# EAGLE design Alimentation (EAGLE 9.3.2)
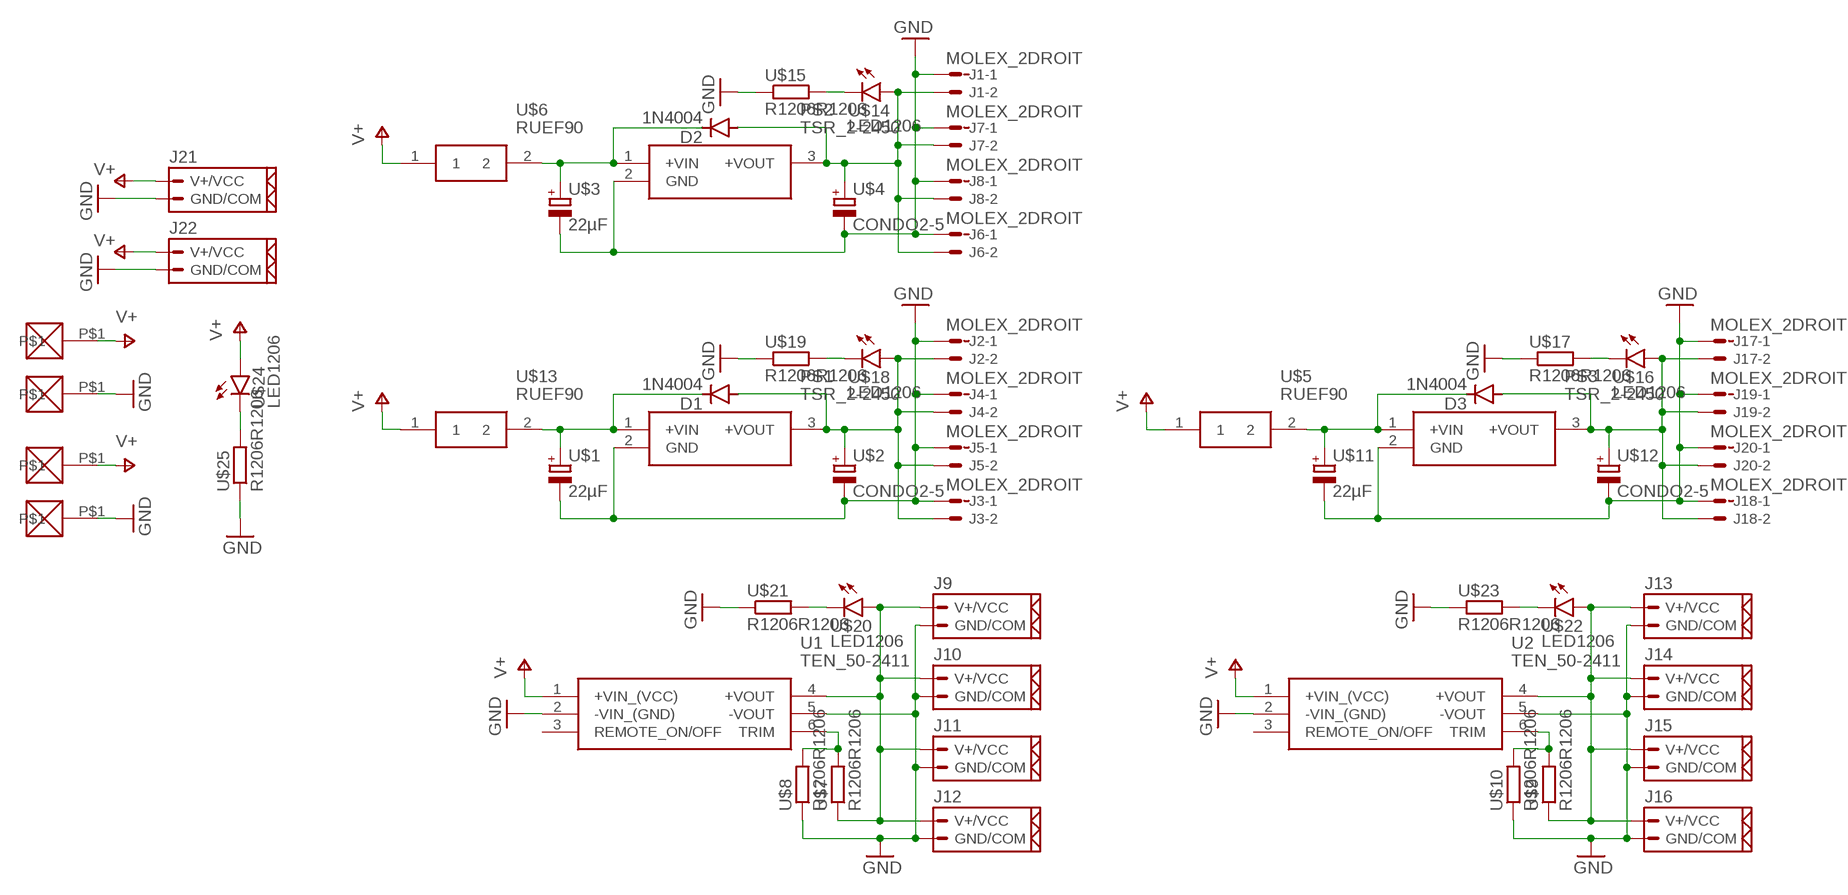
[diagram p0: schematic, sheet 1]

## Parts
D1  1N4004  [DO41-10]
D2  1N4004  [DO41-10]
D3  1N4004  [DO41-10]
J1  MOLEX_2DROIT  [CON_2_DROIT]
J2  MOLEX_2DROIT  [CON_2_DROIT]
J3  MOLEX_2DROIT  [CON_2_DROIT]
J4  MOLEX_2DROIT  [CON_2_DROIT]
J5  MOLEX_2DROIT  [CON_2_DROIT]
J6  MOLEX_2DROIT  [CON_2_DROIT]
J7  MOLEX_2DROIT  [CON_2_DROIT]
J8  MOLEX_2DROIT  [CON_2_DROIT]
J9  MOLEX_2_PUISSDROIT  [CON_2_PUISS_DROIT]
J10  MOLEX_2_PUISSDROIT  [CON_2_PUISS_DROIT]
J11  MOLEX_2_PUISS90°  [CON_2_PUISS_90°]
J12  MOLEX_2_PUISS90°  [CON_2_PUISS_90°]
J13  MOLEX_2_PUISSDROIT  [CON_2_PUISS_DROIT]
J14  MOLEX_2_PUISSDROIT  [CON_2_PUISS_DROIT]
J15  MOLEX_2_PUISS90°  [CON_2_PUISS_90°]
J16  MOLEX_2_PUISS90°  [CON_2_PUISS_90°]
J17  MOLEX_2DROIT  [CON_2_DROIT]
J18  MOLEX_2DROIT  [CON_2_DROIT]
J19  MOLEX_2DROIT  [CON_2_DROIT]
J20  MOLEX_2DROIT  [CON_2_DROIT]
J21  MOLEX_2_PUISS90°  [CON_2_PUISS_90°]
J22  MOLEX_2_PUISS90°  [CON_2_PUISS_90°]
PS1  TSR_2-2450  [TSR-2]
PS2  TSR_2-2450  [TSR-2]
PS3  TSR_2-2450  [TSR-2]
U1  TEN_50-2411  [TEN_50-2411]
U2  TEN_50-2411  [TEN_50-2411]
U$1  22µF  CONDO2-5  [E2-5]
U$2  CONDO2-5  [E2-5]
U$3  22µF  CONDO2-5  [E2-5]
U$4  CONDO2-5  [E2-5]
U$5  RUEF90  [RUEF090]
U$6  RUEF90  [RUEF090]
U$7  R1206R1206  [R1206]
U$8  R1206R1206  [R1206]
U$9  R1206R1206  [R1206]
U$10  R1206R1206  [R1206]
U$11  22µF  CONDO2-5  [E2-5]
U$12  CONDO2-5  [E2-5]
U$13  RUEF90  [RUEF090]
U$14  LED1206  [1206]
U$15  R1206R1206  [R1206]
U$16  LED1206  [1206]
U$17  R1206R1206  [R1206]
U$18  LED1206  [1206]
U$19  R1206R1206  [R1206]
U$20  LED1206  [1206]
U$21  R1206R1206  [R1206]
U$22  LED1206  [1206]
U$23  R1206R1206  [R1206]
U$24  LED1206  [1206]
U$25  R1206R1206  [R1206]
U$26  BAT_WIRE_SOLD  [LARGE_PAD_BATT]
U$27  BAT_WIRE_SOLD  [LARGE_PAD_BATT]
U$28  BAT_WIRE_SOLD  [LARGE_PAD_BATT]
U$29  BAT_WIRE_SOLD  [LARGE_PAD_BATT]

## Nets
GND: J1.1 J2.1 J3.1 J4.1 J5.1 J6.1 J7.1 J8.1 J9.1(GND/COM) J10.1(GND/COM) J11.P$1(GND/COM) J12.P$1(GND/COM) J13.1(GND/COM) J14.1(GND/COM) J15.P$1(GND/COM) J16.P$1(GND/COM) J17.1 J18.1 J19.1 J20.1 J21.P$1(GND/COM) J22.P$1(GND/COM) PS1.2(GND) PS2.2(GND) PS3.2(GND) U1.2(-VIN_(GND)) U1.5(-VOUT) U2.2(-VIN_(GND)) U2.5(-VOUT) U$1.- U$2.- U$3.- U$4.- U$8.1 U$10.1 U$11.- U$12.- U$15.1 U$17.1 U$19.1 U$21.1 U$23.1 U$25.1 U$26.P$1 U$28.P$1
N$1: D1.C PS1.1(+VIN) U$1.+ U$13.2
N$2: D2.C PS2.1(+VIN) U$3.+ U$6.2
N$3: D2.A J1.2 J6.2 J7.2 J8.2 PS2.3(+VOUT) U$4.+ U$14.A
N$4: J9.2(V+/VCC) J10.2(V+/VCC) J11.P$2(V+/VCC) J12.P$2(V+/VCC) U1.4(+VOUT) U$7.1 U$20.A
N$6: U1.6(TRIM) U$7.2 U$8.2
N$7: D1.A J2.2 J3.2 J4.2 J5.2 PS1.3(+VOUT) U$2.+ U$18.A
N$8: J13.2(V+/VCC) J14.2(V+/VCC) J15.P$2(V+/VCC) J16.P$2(V+/VCC) U2.4(+VOUT) U$9.1 U$22.A
N$10: U2.6(TRIM) U$9.2 U$10.2
N$11: D3.C PS3.1(+VIN) U$5.2 U$11.+
N$12: D3.A J17.2 J18.2 J19.2 J20.2 PS3.3(+VOUT) U$12.+ U$16.A
N$13: U$14.C U$15.2
N$14: U$16.C U$17.2
N$15: U$18.C U$19.2
N$16: U$20.C U$21.2
N$17: U$22.C U$23.2
N$18: U$24.C U$25.2
V+: J21.P$2(V+/VCC) J22.P$2(V+/VCC) U1.1(+VIN_(VCC)) U2.1(+VIN_(VCC)) U$5.1 U$6.1 U$13.1 U$24.A U$27.P$1 U$29.P$1
Unconnected: U1.3(REMOTE_ON/OFF) U2.3(REMOTE_ON/OFF)

## Library data of the parts
D1-D3 = AREA:1N4004: DIODE general purpose rectifier, 1 A
J1-J8 J17-J20 = AREA:MOLEX_2: CONNECTOR wire to board 2.54 mm (.1 inch) pitch header; MF: MOLEX; OC_FARNELL: unknown; OC_NEWARK: unknown
J9-J16 J21 J22 = AREA:MOLEX_2_PUISS: Solid Header 3.96mm KK ,r/a,F/Lock,2w Molex KK Series, Series Number 41792, 3.96mm Pitch 2 Way 1 Row Right Angle PCB Header, Solder Termination, 7A Source: Datasheet <http://www.molex.com/webdocs/datasheets/pdf/en-us/0026605020_PCB_HEADERS.pdf>
PS1-PS3 = AREA:TSR_2-2450: Switching Regulator 5Vout 2A TRACOPOWER Switching Regulator, 6.5 36V dc Input, 5V dc Output, Maximum of 2A Source: Datasheet <https://componentsearchengine.com/Datasheets/1/TSR 2-2450.pdf>; ALLIED_NUMBER: 71066183; ALLIED_PRICE-STOCK: https://www.alliedelec.com/tracopower-tsr-2-2450/71066183/; DESCRIPTION: Switching Regulator 5Vout 2A TRACOPOWER Switching Regulator, 6.5 36V dc Input, 5V dc Output, Maximum of 2A; HEIGHT: mm; MANUFACTURER_NAME: Traco Power; MANUFACTURER_PART_NUMBER: TSR 2-2450; MOUSER_PART_NUMBER: 495-TSR2-2450; MOUSER_PRICE-STOCK: https://www.mouser.com/Search/Refine.aspx?Keyword=495-TSR2-2450; RS_PART_NUMBER: 1666063; RS_PRICE-STOCK: http://uk.rs-online.com/web/p/products/1666063
U1 U2 = AREA:TEN_50-2411: TRACOPOWER 50W Isolated DC-DC Converter, Vin 18 36 V dc, Vout 5V dc, I/O isolation 1500V dc Source: Datasheet <http://www.tracopower.com/products/ten50.pdf>; DESCRIPTION: TRACOPOWER 50W Isolated DC-DC Converter, Vin 18 36 V dc, Vout 5V dc, I/O isolation 1500V dc; HEIGHT: mm; MANUFACTURER_NAME: Traco Power; MANUFACTURER_PART_NUMBER: TEN 50-2411; RS_PART_NUMBER: 7702299; RS_PRICE/STOCK: http://uk.rs-online.com/web/p/products/7702299
U$1-U$4 U$11 U$12 = AREA:CONDO
U$5 U$6 U$13 = AREA:RUEF
U$7-U$10 U$15 U$17 U$19 U$21 U$23 U$25 = AREA:R1206
U$14 U$16 U$18 U$20 U$22 U$24 = AREA:LED1206
U$26-U$29 = AREA:BAT_WIRE_SOLD

## Board
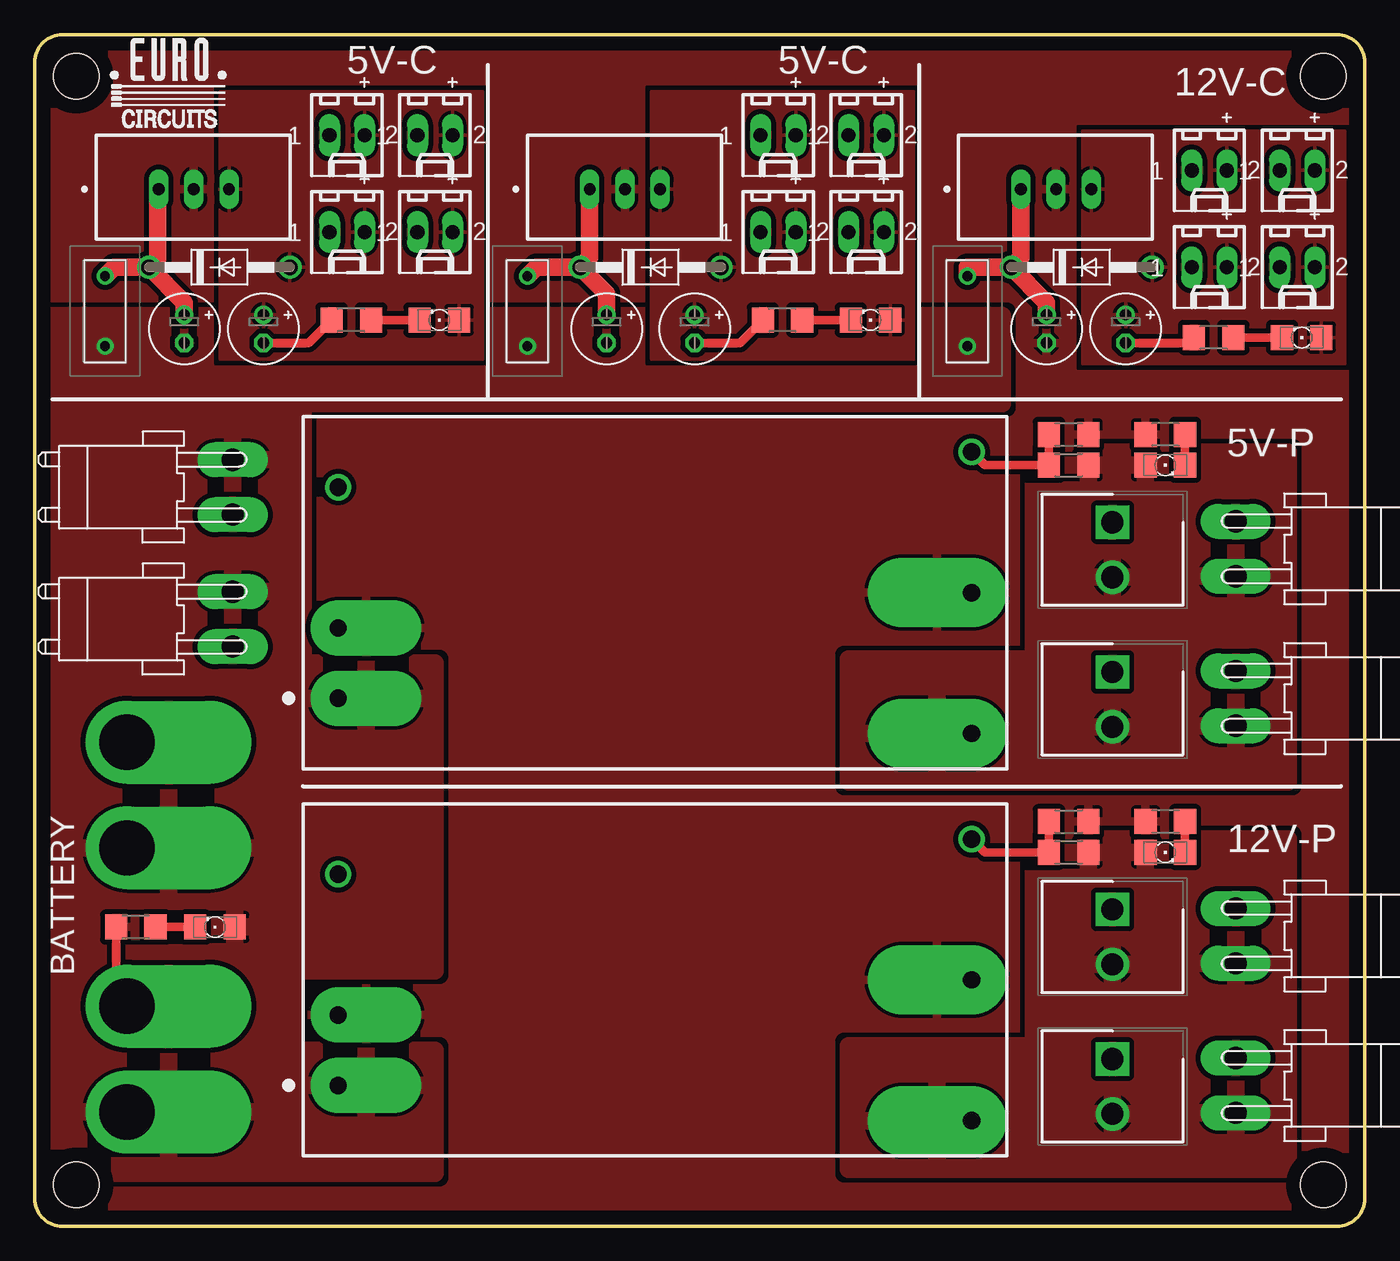
[diagram p1: board, top side]
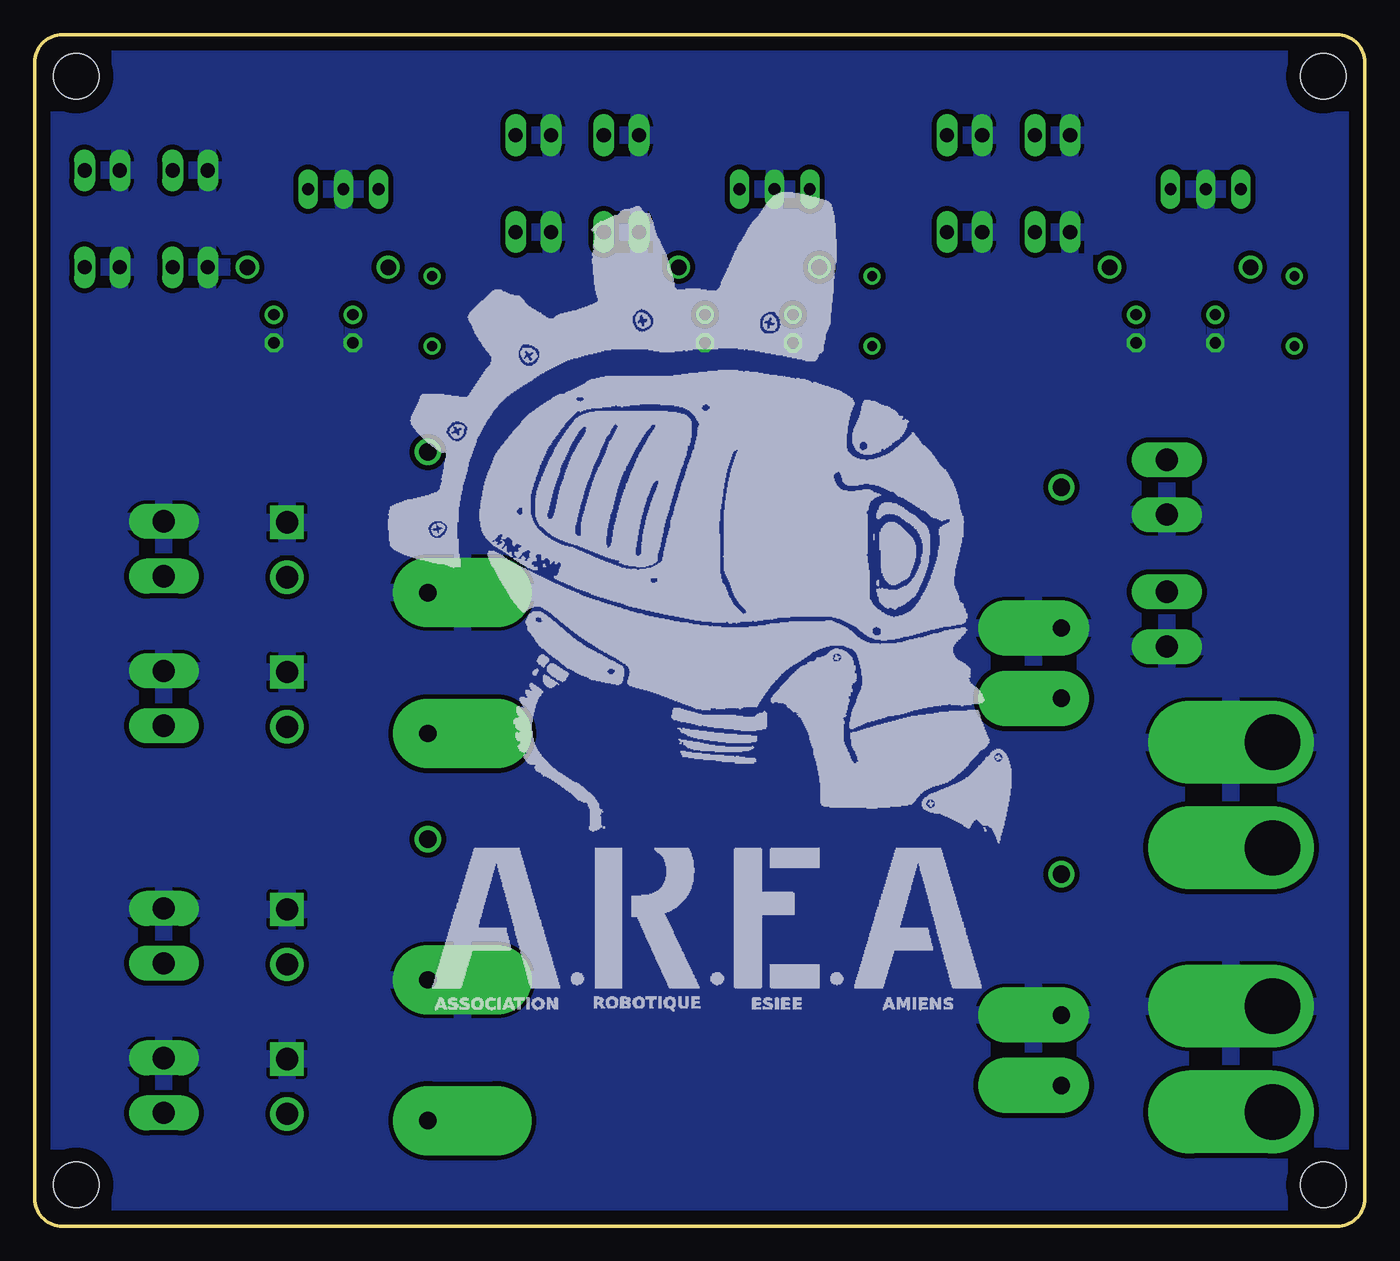
[diagram p2: board, bottom side, seen from below]

Size 96 x 86 mm. Coordinates in mm from the lower left corner, seen from the top.
Outline: 96,84 arc90 94,86 2,86 arc90 0,84 0,2 arc90 2,0 94,0 arc90 96,2 96,84
Copper layers (1*16): Top 0.035mm / dielectric 1.5mm / Bottom 0.035mm
Design rules "default *": minimum track width 6mil, minimum drill 0.35mm, track to track 14mil, track to pad 14mil, pad to pad 12mil, via to via 12mil, smd to smd 10mil, copper to edge 40mil, drill to drill 6mil, minimum pad ring 10mil, minimum via ring 8mil, stop-mask expansion 4mil, vias tented up to drill 0mil, thermal gap 10mil
Holes 3.3 mm at 3,3 93,83 93,3 3,83

### Footprints (pad centres in the part's own frame; a part is rotated, then mirrored left to right if it is on the bottom)
DO41-10 = drill 1.118: A 5.08,0; C -5.08,0
CON_2_DROIT = drill 1.016 long: 1 1.27,0; 2 -1.27,0
CON_2_PUISS_DROIT = drill 1.6 pad 2.4 square: 1 0,0 | drill 1.6 pad 2.4: 2 3.96,0
CON_2_PUISS_90° = drill 1.6 pad 2.54 long: P$1 -1.98,0; P$2 1.98,0
TSR-2 = drill 0.85 pad 1.422 long: 1 4.5,-3.89; 2 7.04,-3.89; 3 9.58,-3.89
TEN_50-2411 = drill 1.25 pad 4 offset: 1 -48.26,-20.32; 2 -48.26,-15.24 | drill 1.25 pad 1.9: 3 -48.26,-5.08; 6 -2.54,-2.54 | drill 1.25 pad 5 offset: 4 -2.54,-22.86; 5 -2.54,-12.7
E2-5 = drill 0.813 pad 1.27: + -1.016,0 | drill 0.813 pad 1.27 octagon: - 1.016,0
RUEF090 = drill 0.71 pad 1.217: 1 -2.525,0; 2 2.525,0
R1206 = smd 1.6 x 1.803: 1 -1.422,0; 2 1.422,0
1206 = smd 1.6 x 1.803: A -1.422,0; C 1.422,0
LARGE_PAD_BATT = drill 4 pad 6 offset: P$1 0,0

### Placement (x,y rotation side)
D1  44.45,69.22 0 top
D2  13.34,69.22 0 top
D3  75.56,69.22 0 top
J1  22.54,71.75 180 top
J2  53.66,78.74 180 top
J3  53.66,71.75 180 top
J4  60.01,78.74 180 top
J5  60.01,71.75 180 top
J6  22.54,78.74 180 top
J7  28.89,71.75 180 top
J8  28.89,78.74 180 top
J9  77.79,40.01 270 top
J10  77.79,50.8 270 top
J11  86.68,38.1 270 top
J12  86.68,48.9 270 top
J13  77.79,22.86 270 top
J14  77.79,12.06 270 top
J15  86.68,10.16 270 top
J16  86.68,20.95 270 top
J17  91.12,76.2 180 top
J18  91.12,69.22 180 top
J19  84.77,76.2 180 top
J20  84.77,69.22 180 top
J21  14.29,53.34 90 top
J22  14.29,43.81 90 top
PS1  35.56,78.74 0 top
PS2  4.45,78.74 0 top
PS3  66.67,78.74 0 top
U1  70.17,58.42 0 top
U2  70.17,30.48 0 top
U$1  41.27,64.77 270 top
U$2  47.62,64.77 270 top
U$3  10.79,64.77 270 top
U$4  16.51,64.77 270 top
U$5  67.31,66.04 90 top
U$6  5.08,66.04 90 top
U$7  74.61,54.93 180 top
U$8  74.61,57.15 180 top
U$9  74.61,26.99 180 top
U$10  74.61,29.21 180 top
U$11  73.03,64.77 270 top
U$12  78.74,64.77 270 top
U$13  35.56,66.04 90 top
U$14  29.21,65.41 180 top
U$15  22.86,65.41 0 top
U$16  91.44,64.14 180 top
U$17  85.09,64.14 0 top
U$18  60.33,65.41 180 top
U$19  53.98,65.41 0 top
U$20  81.6,54.93 0 top
U$21  81.6,57.15 0 top
U$22  81.6,26.99 0 top
U$23  81.6,29.21 0 top
U$24  13.02,21.59 180 top
U$25  7.3,21.59 0 top
U$26  6.67,34.92 270 top
U$27  6.67,27.3 270 top
U$28  6.67,15.88 270 top
U$29  6.67,8.26 270 top

### Tracks (layer width: path | path; a pad name or v marks a point on that pad's centre or on a via)
GND
  Top 0.61: U$25.1 5.88,16.66 U$28.P$1 | U$12.- 83.29,63.75 U$17.1 | U$2.- 50.9,63.75 U$19.1 | U$4.- 19.79,63.75 U$15.1
  pour Bottom: -5.4,92.71 -5.4,-4.45 112.39,-4.45 112.39,92.71
  pour Top (rank 3): -2.86,-2.86 109.86,-2.86 109.86,89.85 -2.86,89.85
N$1
  Top 1.27: D1.C 36.21,69.22 U$13.2 | D1.C 41.27,67.31 U$1.+ | PS1.1 40.06,69.91 D1.C
N$2
  Top 1.27: PS2.1 8.89,74.8 8.89,69.85 D2.C | D2.C 10.79,66.67 U$3.+ | D2.C 5.73,69.22 U$6.2
N$3
  pour Top: 32.38,81.92 13.34,81.92 13.34,62.55 32.38,62.55
N$4
  pour Top: 58.74,40.96 58.74,32.07 90.49,32.07 90.49,55.88 72.07,55.88 72.07,40.96
N$6
  Top 0.61: U1.6 68.58,54.93 U$7.2 U$8.2
N$7
  pour Top: 63.5,81.92 44.45,81.92 44.45,62.55 63.5,62.55
N$8
  pour Top: 58.74,13.02 58.74,4.13 90.49,4.13 90.49,27.94 72.07,27.94 72.07,13.02
N$10
  Top 0.61: U$10.2 U$9.2 68.58,26.99 U2.6
N$11
  Top 1.27: D3.C 67.31,69.22 U$5.2 | D3.C 73.03,66.67 U$11.+ | D3.C 71.17,69.91 PS3.1
N$12
  pour Top: 94.61,79.06 75.56,79.06 75.56,62.23 94.61,62.23
N$13
  Top 0.61: U$14.C U$15.2
N$14
  Top 0.61: U$17.2 U$16.C
N$15
  Top 0.61: U$18.C U$19.2
N$16
  Top 0.61: U$21.2 U$20.C
N$17
  Top 0.61: U$23.2 U$22.C
N$18
  Top 0.61: U$25.2 U$24.C
V+
  pour Top (rank 2): 0.32,3.81 28.89,3.81 28.89,12.7 18.73,12.7 18.73,18.41 28.89,18.41 28.89,40.64 19.37,40.64 19.37,59.37 69.85,59.37 69.85,65.72 0.32,65.72

### Text on the board
tNames: 5V-C | 5V-C | 12V-C | 5V-P | 12V-P | BATTERY